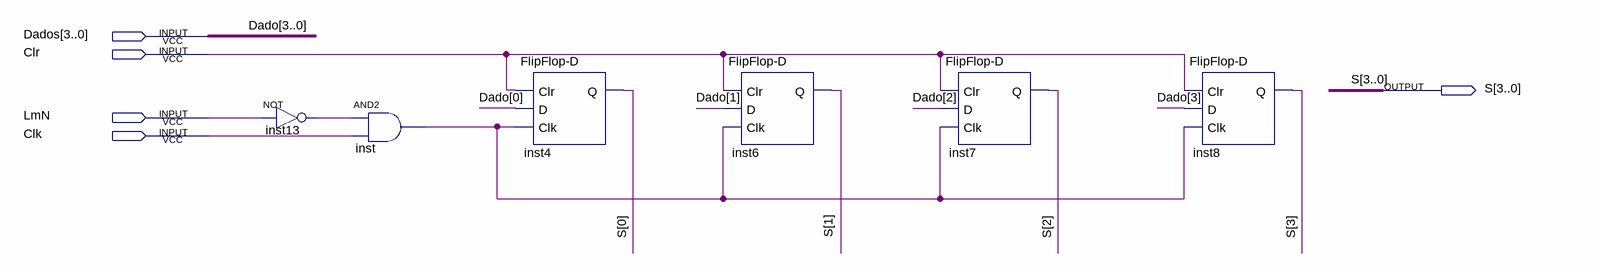
[diagram p0: schematic sheet]
// Quartus schematic REM.bdf as structural Verilog: 6 symbols, 5 pins
module REM (
  input  [3:0] Dados,
  input  Clr,
  input  LmN,
  input  Clk,
  output [3:0] S
);

  wire inst13_out, inst_out;

  not inst13 (inst13_out, LmN);
  and inst (inst_out, inst13_out, Clk);
  \FlipFlop-D  inst4 (.Clr(Clr), .D(Dados[0]), .Clk(inst_out), .Q(S[0]));
  \FlipFlop-D  inst6 (.Clr(Clr), .D(Dados[1]), .Clk(inst_out), .Q(S[1]));
  \FlipFlop-D  inst7 (.Clr(Clr), .D(Dados[2]), .Clk(inst_out), .Q(S[2]));
  \FlipFlop-D  inst8 (.Clr(Clr), .D(Dados[3]), .Clk(inst_out), .Q(S[3]));

  // Other names for the same wires on the sheet: Dado[3:0] = Dados
endmodule
